# Altium schematic sheet 2Teclado.SchDoc
size A4
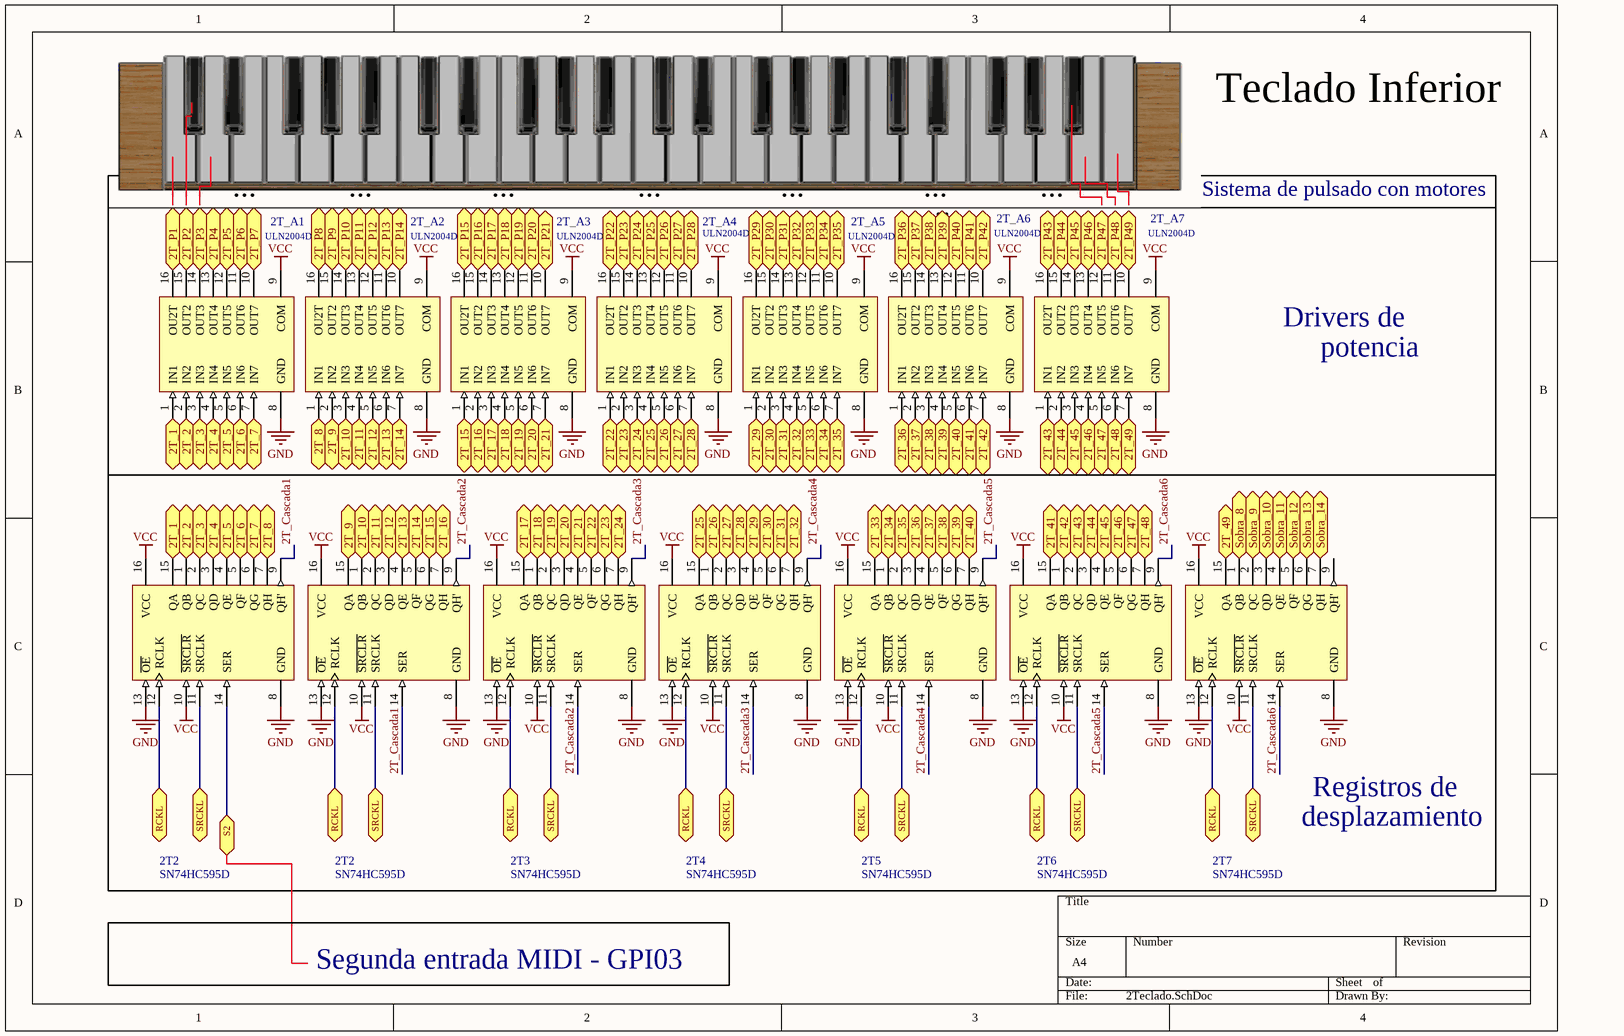
[diagram p0: 2Teclado.SchDoc]

## Parts
(Parts that share a designator on the sheet are numbered #1, #2 ... from top to bottom, then left to right.)
2T2#1  SN74HC595D  [D016_N]
2T2#2  SN74HC595D  [D016_N]
2T3  SN74HC595D  [D016_N]
2T4  SN74HC595D  [D016_N]
2T5  SN74HC595D  [D016_N]
2T6  SN74HC595D  [D016_N]
2T7  SN74HC595D  [D016_N]
2T_A1  ULN2004D  [SO16_N]
2T_A2  ULN2004D  [SO16_N]
2T_A3  ULN2004D  [SO16_N]
2T_A4  ULN2004D  [SO16_N]
2T_A5  ULN2004D  [SO16_N]
2T_A6  ULN2004D  [SO16_N]
2T_A7  ULN2004D  [SO16_N]

## Ports
2T_1, 2T_2, 2T_3, 2T_4, 2T_5, 2T_6, 2T_7, 2T_8, 2T_9, 2T_10, 2T_11, 2T_12, 2T_13, 2T_14, 2T_15, 2T_16, 2T_17, 2T_18, 2T_19, 2T_20, 2T_21, 2T_22, 2T_23, 2T_24, 2T_25, 2T_26, 2T_27, 2T_28, 2T_29, 2T_30, 2T_31, 2T_32, 2T_33, 2T_34, 2T_35, 2T_36, 2T_37, 2T_38, 2T_39, 2T_40, 2T_41, 2T_42, 2T_43, 2T_44, 2T_45, 2T_46, 2T_47, 2T_48, 2T_49, 2T_P1, 2T_P2, 2T_P3, 2T_P4, 2T_P5, 2T_P6, 2T_P7, 2T_P8, 2T_P9, 2T_P10, 2T_P11, 2T_P12, 2T_P13, 2T_P14, 2T_P15, 2T_P16, 2T_P17, 2T_P18, 2T_P19, 2T_P20, 2T_P21, 2T_P22, 2T_P23, 2T_P24, 2T_P25, 2T_P26, 2T_P27, 2T_P28, 2T_P29, 2T_P30, 2T_P31, 2T_P32, 2T_P33, 2T_P34, 2T_P35, 2T_P36, 2T_P37, 2T_P38, 2T_P39, 2T_P40, 2T_P41, 2T_P42, 2T_P43, 2T_P44, 2T_P45, 2T_P46, 2T_P47, 2T_P48, 2T_P49, RCKL, S2, Sobra_8, Sobra_9, Sobra_10, Sobra_11, Sobra_12, Sobra_13, Sobra_14, SRCKL

## Nets
GND: 2T2#1.8(GND) 2T2#1.13(~{OE}) 2T2#2.8(GND) 2T2#2.13(~{OE}) 2T3.8(GND) 2T3.13(~{OE}) 2T4.8(GND) 2T4.13(~{OE}) 2T5.8(GND) 2T5.13(~{OE}) 2T6.8(GND) 2T6.13(~{OE}) 2T7.8(GND) 2T7.13(~{OE}) 2T_A1.8(GND) 2T_A2.8(GND) 2T_A3.8(GND) 2T_A4.8(GND) 2T_A5.8(GND) 2T_A6.8(GND) 2T_A7.8(GND)
VCC: 2T2#1.10(~{SRCLR}) 2T2#1.16(VCC) 2T2#2.10(~{SRCLR}) 2T2#2.16(VCC) 2T3.10(~{SRCLR}) 2T3.16(VCC) 2T4.10(~{SRCLR}) 2T4.16(VCC) 2T5.10(~{SRCLR}) 2T5.16(VCC) 2T6.10(~{SRCLR}) 2T6.16(VCC) 2T7.10(~{SRCLR}) 2T7.16(VCC) 2T_A1.9(COM) 2T_A2.9(COM) 2T_A3.9(COM) 2T_A4.9(COM) 2T_A5.9(COM) 2T_A6.9(COM) 2T_A7.9(COM)
2T_1: 2T2#1.15(QA) 2T_A1.1(IN1) ; port 2T_1
2T_2: 2T2#1.1(QB) 2T_A1.2(IN2) ; port 2T_2
2T_3: 2T2#1.2(QC) 2T_A1.3(IN3) ; port 2T_3
2T_4: 2T2#1.3(QD) 2T_A1.4(IN4) ; port 2T_4
2T_5: 2T2#1.4(QE) 2T_A1.5(IN5) ; port 2T_5
2T_6: 2T2#1.5(QF) 2T_A1.6(IN6) ; port 2T_6
2T_7: 2T2#1.6(QG) 2T_A1.7(IN7) ; port 2T_7
2T_8: 2T2#1.7(QH) 2T_A2.1(IN1) ; port 2T_8
2T_9: 2T2#2.15(QA) 2T_A2.2(IN2) ; port 2T_9
2T_10: 2T2#2.1(QB) 2T_A2.3(IN3) ; port 2T_10
2T_11: 2T2#2.2(QC) 2T_A2.4(IN4) ; port 2T_11
2T_12: 2T2#2.3(QD) 2T_A2.5(IN5) ; port 2T_12
2T_13: 2T2#2.4(QE) 2T_A2.6(IN6) ; port 2T_13
2T_14: 2T2#2.5(QF) 2T_A2.7(IN7) ; port 2T_14
2T_15: 2T2#2.6(QG) 2T_A3.1(IN1) ; port 2T_15
2T_16: 2T2#2.7(QH) 2T_A3.2(IN2) ; port 2T_16
2T_17: 2T3.15(QA) 2T_A3.3(IN3) ; port 2T_17
2T_18: 2T3.1(QB) 2T_A3.4(IN4) ; port 2T_18
2T_19: 2T3.2(QC) 2T_A3.5(IN5) ; port 2T_19
2T_20: 2T3.3(QD) 2T_A3.6(IN6) ; port 2T_20
2T_21: 2T3.4(QE) 2T_A3.7(IN7) ; port 2T_21
2T_22: 2T3.5(QF) 2T_A4.1(IN1) ; port 2T_22
2T_23: 2T3.6(QG) 2T_A4.2(IN2) ; port 2T_23
2T_24: 2T3.7(QH) 2T_A4.3(IN3) ; port 2T_24
2T_25: 2T4.15(QA) 2T_A4.4(IN4) ; port 2T_25
2T_26: 2T4.1(QB) 2T_A4.5(IN5) ; port 2T_26
2T_27: 2T4.2(QC) 2T_A4.6(IN6) ; port 2T_27
2T_28: 2T4.3(QD) 2T_A4.7(IN7) ; port 2T_28
2T_29: 2T4.4(QE) 2T_A5.1(IN1) ; port 2T_29
2T_30: 2T4.5(QF) 2T_A5.2(IN2) ; port 2T_30
2T_31: 2T4.6(QG) 2T_A5.3(IN3) ; port 2T_31
2T_32: 2T4.7(QH) 2T_A5.4(IN4) ; port 2T_32
2T_33: 2T5.15(QA) 2T_A5.5(IN5) ; port 2T_33
2T_34: 2T5.1(QB) 2T_A5.6(IN6) ; port 2T_34
2T_35: 2T5.2(QC) 2T_A5.7(IN7) ; port 2T_35
2T_36: 2T5.3(QD) 2T_A6.1(IN1) ; port 2T_36
2T_37: 2T5.4(QE) 2T_A6.2(IN2) ; port 2T_37
2T_38: 2T5.5(QF) 2T_A6.3(IN3) ; port 2T_38
2T_39: 2T5.6(QG) 2T_A6.4(IN4) ; port 2T_39
2T_40: 2T5.7(QH) 2T_A6.5(IN5) ; port 2T_40
2T_41: 2T6.15(QA) 2T_A6.6(IN6) ; port 2T_41
2T_42: 2T6.1(QB) 2T_A6.7(IN7) ; port 2T_42
2T_43: 2T6.2(QC) 2T_A7.1(IN1) ; port 2T_43
2T_44: 2T6.3(QD) 2T_A7.2(IN2) ; port 2T_44
2T_45: 2T6.4(QE) 2T_A7.3(IN3) ; port 2T_45
2T_46: 2T6.5(QF) 2T_A7.4(IN4) ; port 2T_46
2T_47: 2T6.6(QG) 2T_A7.5(IN5) ; port 2T_47
2T_48: 2T6.7(QH) 2T_A7.6(IN6) ; port 2T_48
2T_49: 2T7.15(QA) 2T_A7.7(IN7) ; port 2T_49
2T_Cascada1: 2T2#1.9(QH') 2T2#2.14(SER)
2T_Cascada2: 2T2#2.9(QH') 2T3.14(SER)
2T_Cascada3: 2T3.9(QH') 2T4.14(SER)
2T_Cascada4: 2T4.9(QH') 2T5.14(SER)
2T_Cascada5: 2T5.9(QH') 2T6.14(SER)
2T_Cascada6: 2T6.9(QH') 2T7.14(SER)
2T_P1: 2T_A1.16(OU2T) ; port 2T_P1
2T_P2: 2T_A1.15(OUT2) ; port 2T_P2
2T_P3: 2T_A1.14(OUT3) ; port 2T_P3
2T_P4: 2T_A1.13(OUT4) ; port 2T_P4
2T_P5: 2T_A1.12(OUT5) ; port 2T_P5
2T_P6: 2T_A1.11(OUT6) ; port 2T_P6
2T_P7: 2T_A1.10(OUT7) ; port 2T_P7
2T_P8: 2T_A2.16(OU2T) ; port 2T_P8
2T_P9: 2T_A2.15(OUT2) ; port 2T_P9
2T_P10: 2T_A2.14(OUT3) ; port 2T_P10
2T_P11: 2T_A2.13(OUT4) ; port 2T_P11
2T_P12: 2T_A2.12(OUT5) ; port 2T_P12
2T_P13: 2T_A2.11(OUT6) ; port 2T_P13
2T_P14: 2T_A2.10(OUT7) ; port 2T_P14
2T_P15: 2T_A3.16(OU2T) ; port 2T_P15
2T_P16: 2T_A3.15(OUT2) ; port 2T_P16
2T_P17: 2T_A3.14(OUT3) ; port 2T_P17
2T_P18: 2T_A3.13(OUT4) ; port 2T_P18
2T_P19: 2T_A3.12(OUT5) ; port 2T_P19
2T_P20: 2T_A3.11(OUT6) ; port 2T_P20
2T_P21: 2T_A3.10(OUT7) ; port 2T_P21
2T_P22: 2T_A4.16(OU2T) ; port 2T_P22
2T_P23: 2T_A4.15(OUT2) ; port 2T_P23
2T_P24: 2T_A4.14(OUT3) ; port 2T_P24
2T_P25: 2T_A4.13(OUT4) ; port 2T_P25
2T_P26: 2T_A4.12(OUT5) ; port 2T_P26
2T_P27: 2T_A4.11(OUT6) ; port 2T_P27
2T_P28: 2T_A4.10(OUT7) ; port 2T_P28
2T_P29: 2T_A5.16(OU2T) ; port 2T_P29
2T_P30: 2T_A5.15(OUT2) ; port 2T_P30
2T_P31: 2T_A5.14(OUT3) ; port 2T_P31
2T_P32: 2T_A5.13(OUT4) ; port 2T_P32
2T_P33: 2T_A5.12(OUT5) ; port 2T_P33
2T_P34: 2T_A5.11(OUT6) ; port 2T_P34
2T_P35: 2T_A5.10(OUT7) ; port 2T_P35
2T_P36: 2T_A6.16(OU2T) ; port 2T_P36
2T_P37: 2T_A6.15(OUT2) ; port 2T_P37
2T_P38: 2T_A6.14(OUT3) ; port 2T_P38
2T_P39: 2T_A6.13(OUT4) ; port 2T_P39
2T_P40: 2T_A6.12(OUT5) ; port 2T_P40
2T_P41: 2T_A6.11(OUT6) ; port 2T_P41
2T_P42: 2T_A6.10(OUT7) ; port 2T_P42
2T_P43: 2T_A7.16(OU2T) ; port 2T_P43
2T_P44: 2T_A7.15(OUT2) ; port 2T_P44
2T_P45: 2T_A7.14(OUT3) ; port 2T_P45
2T_P46: 2T_A7.13(OUT4) ; port 2T_P46
2T_P47: 2T_A7.12(OUT5) ; port 2T_P47
2T_P48: 2T_A7.11(OUT6) ; port 2T_P48
2T_P49: 2T_A7.10(OUT7) ; port 2T_P49
RCKL: 2T2#1.12(RCLK) 2T2#2.12(RCLK) 2T3.12(RCLK) 2T4.12(RCLK) 2T5.12(RCLK) 2T6.12(RCLK) 2T7.12(RCLK) ; port RCKL
S2: 2T2#1.14(SER) ; port S2
Sobra_8: 2T7.1(QB) ; port Sobra_8
Sobra_9: 2T7.2(QC) ; port Sobra_9
Sobra_10: 2T7.3(QD) ; port Sobra_10
Sobra_11: 2T7.4(QE) ; port Sobra_11
Sobra_12: 2T7.5(QF) ; port Sobra_12
Sobra_13: 2T7.6(QG) ; port Sobra_13
Sobra_14: 2T7.7(QH) ; port Sobra_14
SRCKL: 2T2#1.11(SRCLK) 2T2#2.11(SRCLK) 2T3.11(SRCLK) 2T4.11(SRCLK) 2T5.11(SRCLK) 2T6.11(SRCLK) 2T7.11(SRCLK) ; port SRCKL

Not connected (* = marked no-connect by the designer): 2T7 9(QH')

## Notes on the sheet
- Teclado Inferior
- ...
- Sistema de pulsado con motores
- Drivers de
- potencia
- desplazamiento
- Registros de
- Segunda entrada MIDI - GPI03

## Library data of the parts
2T2#1 2T2#2 2T3-2T7 = SN74HC595D: 8-Bit Shift Register with 3-State Output Registers; Published: 8-Jun-2000; LatestRevisionDate: 13-Apr-2006; LatestRevisionNote: IPC-7351 Footprint Added.; DatasheetVersion: May-1997; PackageVersion: Jan-1998; PackageReference: D016; Publisher: Altium Limited; PackageDescription: 16-Pin Small Outline Integrated Circuit 1.27 mm Pitch; Code_IPC: SOIC127P600-16; ComponentLink1Description: Manufacturer Link; ComponentLink1URL: http://www.ti.com/; ComponentLink2Description: Datasheet; ComponentLink2URL: http://www-s.ti.com/sc/ds/sn74hc595.pdf
2T_A1-2T_A7 = ULN2004D: Seven Darlington Array; Published: 8-Jun-2000; LatestRevisionDate: 13-Apr-2006; LatestRevisionNote: IPC-7351 Footprint Added.; DatasheetVersion: Sep-1998; PackageVersion: May-1998; PackageReference: SO16; Publisher: Altium Limited; PackageDescription: 16-Pin Small Outline Integrated Circuit 1.27 mm Pitch; Code_IPC: SOIC127P600-16; ComponentLink1Description: Manufacturer Link; ComponentLink1URL: http://www.st.com/; ComponentLink2Description: Datasheet; ComponentLink2URL: http://www.st.com/stonline/products/literature/ds/5279/uln2001.pdf